# EAGLE design main_V3 (EAGLE 8.5.1)

## Sheet 1 of 8: ESP-12E Main
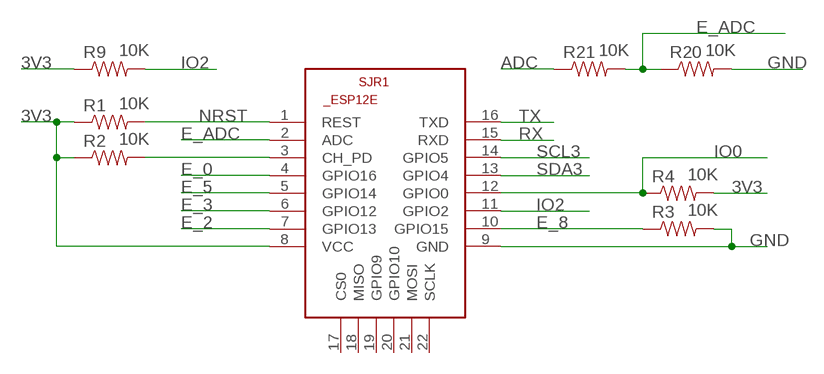
[diagram p0: schematic, sheet 1]

### Parts
R1  10K  RESISTOR1206  [1206]
R2  10K  RESISTOR1206  [1206]
R3  10K  RESISTOR1206  [1206]
R4  10K  RESISTOR1206  [1206]
R9  10K  RESISTOR1206  [1206]
R20  10K  RESISTOR1206  [1206]
R21  10K  RESISTOR1206  [1206]
SJR1  ESP8266-12EESP12E  [ESP8266-ESP12E]

### Nets
3V3: R1.1 R2.1 R4.2 R9.1 SJR1.8(VCC) ; also sheet 5,6
ADC: R21.1 ; also sheet 2
E_0: SJR1.4(GPIO16) ; also sheet 2
E_2: SJR1.7(GPIO13) ; also sheet 2
E_3: SJR1.6(GPIO12) ; also sheet 2
E_5: SJR1.5(GPIO14) ; also sheet 2
E_8: R3.1 SJR1.10(GPIO15) ; also sheet 2
E_ADC: R20.1 R21.2 SJR1.2(ADC)
GND: R3.2 R20.2 SJR1.9(GND) ; also sheet 2,3,5,7,8
IO0: R4.1 SJR1.12(GPIO0) ; also sheet 3
IO2: R9.2 SJR1.11(GPIO2)
N$2: R2.2 SJR1.3(CH_PD)
NRST: R1.2 SJR1.1(REST) ; also sheet 3
RX: SJR1.15(RXD) ; also sheet 2,3
SCL3: SJR1.14(GPIO5) ; also sheet 2,6
SDA3: SJR1.13(GPIO4) ; also sheet 2,6
TX: SJR1.16(TXD) ; also sheet 2,3
Unconnected: SJR1.17(CS0) SJR1.18(MISO) SJR1.19(GPIO9) SJR1.20(GPIO10) SJR1.21(MOSI) SJR1.22(SCLK)

## Sheet 2 of 8: Pads
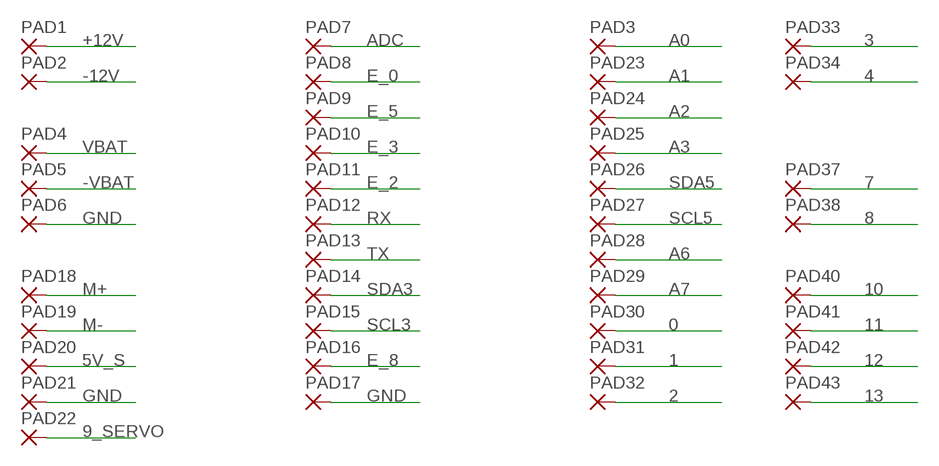
[diagram p1: schematic, sheet 2]

### Parts
PAD1  WIREPADSMD5-2,5  [5-2,5]
PAD2  WIREPADSMD5-2,5  [5-2,5]
PAD3  WIREPADSMD1,27-254  [SMD1,27-2,54]
PAD4  WIREPADSMD5-2,5  [5-2,5]
PAD5  WIREPADSMD5-2,5  [5-2,5]
PAD6  WIREPADSMD5-2,5  [5-2,5]
PAD7  WIREPADSMD1,27-254  [SMD1,27-2,54]
PAD8  WIREPADSMD1,27-254  [SMD1,27-2,54]
PAD9  WIREPADSMD1,27-254  [SMD1,27-2,54]
PAD10  WIREPADSMD1,27-254  [SMD1,27-2,54]
PAD11  WIREPADSMD1,27-254  [SMD1,27-2,54]
PAD12  WIREPADSMD1,27-254  [SMD1,27-2,54]
PAD13  WIREPADSMD1,27-254  [SMD1,27-2,54]
PAD14  WIREPADSMD1,27-254  [SMD1,27-2,54]
PAD15  WIREPADSMD1,27-254  [SMD1,27-2,54]
PAD16  WIREPADSMD1,27-254  [SMD1,27-2,54]
PAD17  WIREPADSMD1,27-254  [SMD1,27-2,54]
PAD18  WIREPADSMD1,27-254  [SMD1,27-2,54]
PAD19  WIREPADSMD1,27-254  [SMD1,27-2,54]
PAD20  WIREPADSMD1,27-254  [SMD1,27-2,54]
PAD21  WIREPADSMD1,27-254  [SMD1,27-2,54]
PAD22  WIREPADSMD1,27-254  [SMD1,27-2,54]
PAD23  WIREPADSMD1,27-254  [SMD1,27-2,54]
PAD24  WIREPADSMD1,27-254  [SMD1,27-2,54]
PAD25  WIREPADSMD1,27-254  [SMD1,27-2,54]
PAD26  WIREPADSMD1,27-254  [SMD1,27-2,54]
PAD27  WIREPADSMD1,27-254  [SMD1,27-2,54]
PAD28  WIREPADSMD1,27-254  [SMD1,27-2,54]
PAD29  WIREPADSMD1,27-254  [SMD1,27-2,54]
PAD30  WIREPADSMD1,27-254  [SMD1,27-2,54]
PAD31  WIREPADSMD1,27-254  [SMD1,27-2,54]
PAD32  WIREPADSMD1,27-254  [SMD1,27-2,54]
PAD33  WIREPADSMD1,27-254  [SMD1,27-2,54]
PAD34  WIREPADSMD1,27-254  [SMD1,27-2,54]
PAD37  WIREPADSMD1,27-254  [SMD1,27-2,54]
PAD38  WIREPADSMD1,27-254  [SMD1,27-2,54]
PAD40  WIREPADSMD1,27-254  [SMD1,27-2,54]
PAD41  WIREPADSMD1,27-254  [SMD1,27-2,54]
PAD42  WIREPADSMD1,27-254  [SMD1,27-2,54]
PAD43  WIREPADSMD1,27-254  [SMD1,27-2,54]

### Nets
0: PAD30.1(P) ; also sheet 7
1: PAD31.1(P) ; also sheet 7
2: PAD32.1(P) ; also sheet 7
3: PAD33.1(P) ; also sheet 7
4: PAD34.1(P) ; also sheet 7
5V_S: PAD20.1(P) ; also sheet 5
7: PAD37.1(P) ; also sheet 7
8: PAD38.1(P) ; also sheet 7
9_SERVO: PAD22.1(P) ; also sheet 7
10: PAD40.1(P) ; also sheet 7
11: PAD41.1(P) ; also sheet 7
12: PAD42.1(P) ; also sheet 7
13: PAD43.1(P) ; also sheet 7
+12V: PAD1.1(P) ; also sheet 4
-12V: PAD2.1(P) ; also sheet 4
-VBAT: PAD5.1(P) ; also sheet 4
A0: PAD3.1(P) ; also sheet 7
A1: PAD23.1(P) ; also sheet 7
A2: PAD24.1(P) ; also sheet 7
A3: PAD25.1(P) ; also sheet 7
A6: PAD28.1(P) ; also sheet 7
A7: PAD29.1(P) ; also sheet 7
ADC: PAD7.1(P) ; also sheet 1
E_0: PAD8.1(P) ; also sheet 1
E_2: PAD11.1(P) ; also sheet 1
E_3: PAD10.1(P) ; also sheet 1
E_5: PAD9.1(P) ; also sheet 1
E_8: PAD16.1(P) ; also sheet 1
GND: PAD6.1(P) PAD17.1(P) PAD21.1(P) ; also sheet 1,3,5,7,8
M+: PAD18.1(P) ; also sheet 8
M-: PAD19.1(P) ; also sheet 8
RX: PAD12.1(P) ; also sheet 1,3
SCL3: PAD15.1(P) ; also sheet 1,6
SCL5: PAD27.1(P) ; also sheet 6,7
SDA3: PAD14.1(P) ; also sheet 1,6
SDA5: PAD26.1(P) ; also sheet 6,7
TX: PAD13.1(P) ; also sheet 1,3
VBAT: PAD4.1(P) ; also sheet 4,5

## Sheet 3 of 8: USB Interface
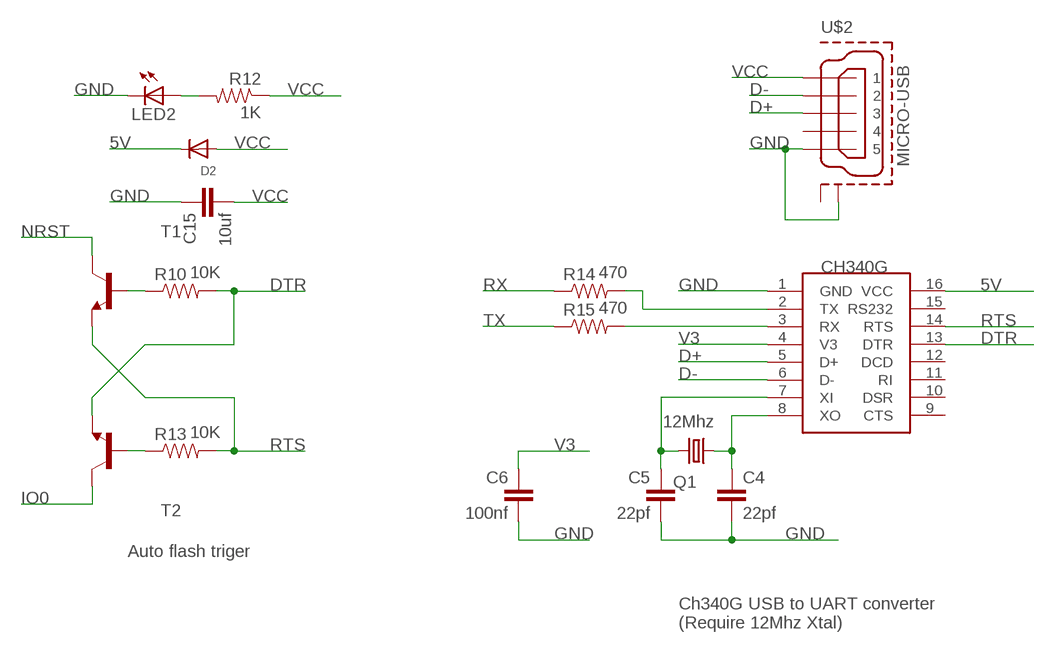
[diagram p2: schematic, sheet 3]

### Parts
C4  22pf  C-EUC1206K  [C1206K]
C5  22pf  C-EUC1206K  [C1206K]
C6  100nf  C-EUC1206K  [C1206K]
C15  10uf  C-EUC1206K  [C1206K]
D2  DIODESMA  [SMADIODE]
LED2  LEDSMT1206  [1206]
Q1  12Mhz  CSM-7X-DU  [CSM-7X-DU]
R10  10K  RESISTOR1206  [1206]
R12  1K  RESISTOR1206  [1206]
R13  10K  RESISTOR1206  [1206]
R14  470  RESISTOR1206  [1206]
R15  470  RESISTOR1206  [1206]
T1  MMBT5551LT1-NPN-SOT23-BEC  [SOT23-BEC]
T2  MMBT5551LT1-NPN-SOT23-BEC  [SOT23-BEC]
U$1  CH340G  [SOIC16]
U$2  MICRO-USB  MICRO-USB-RECEPTACLE47589-0001  [47589-0001]

### Nets
5V: D2.C U$1.16(VCC) ; also sheet 5,6,7
D+: U$1.5(D+) U$2.3
D-: U$1.6(D-) U$2.2
DTR: R10.2 T2.E U$1.13(DTR)
GND: C4.2 C5.2 C6.2 C15.1 LED2.C U$1.1(GND) U$2.5 U$2.P$2(GND2) ; also sheet 1,2,5,7,8
IO0: T2.C ; also sheet 1
N$13: C4.1 Q1.1 U$1.8(XO)
N$14: C5.1 Q1.2 U$1.7(XI)
N$15: R10.1 T1.B
N$18: R13.1 T2.B
N$19: R15.2 U$1.3(RX)
N$20: R14.2 U$1.2(TX)
N$22: LED2.A R12.2
NRST: T1.C ; also sheet 1
RTS: R13.2 T1.E U$1.14(RTS)
RX: R14.1 ; also sheet 1,2
TX: R15.1 ; also sheet 1,2
V3: C6.1 U$1.4(V3)
VCC: C15.2 D2.A R12.1 U$2.1
Unconnected: U$1.9(CTS) U$1.10(DSR) U$1.11(RI) U$1.12(DCD) U$1.15(RS232) U$2.4 U$2.P$1(GND1)

### Notes on the sheet
- Auto flash triger
- Ch340G USB to UART converter 
  (Require 12Mhz Xtal)

## Sheet 4 of 8: Lio-Ion Charging
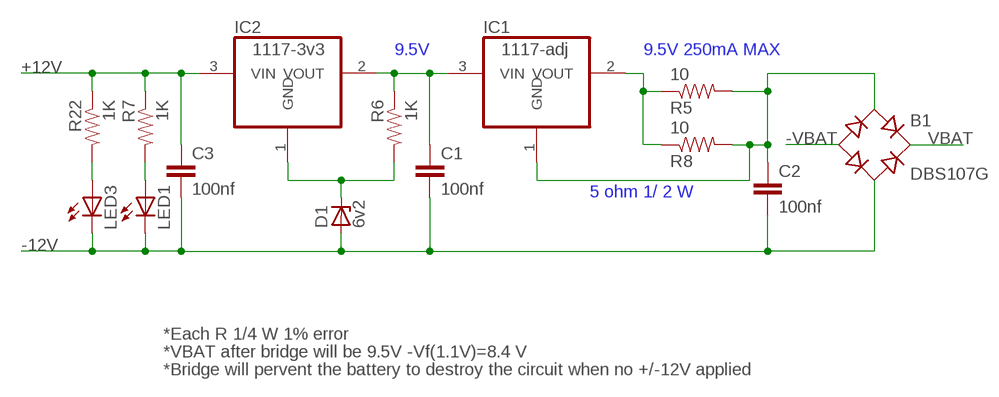
[diagram p3: schematic, sheet 4]

### Parts
B1  DBS107G  [DBS]
C1  100nf  C-EUC1206K  [C1206K]
C2  100nf  C-EUC1206K  [C1206K]
C3  100nf  C-EUC1206K  [C1206K]
D1  6v2  ZENER-DIODESOT23  [SOT23]
IC1  1117-adj  REG1117  [SOT223]
IC2  1117-3v3  REG1117  [SOT223]
LED1  LEDSMT1206  [1206]
LED3  LEDSMT1206  [1206]
R5  10  RESISTOR1206  [1206]
R6  1K  RESISTOR1206  [1206]
R7  1K  RESISTOR1206  [1206]
R8  10  RESISTOR1206  [1206]
R22  1K  RESISTOR1206  [1206]

### Nets
+12V: C3.1 IC2.3(VIN) R7.1 R22.1 ; also sheet 2
-12V: B1.AC2 C1.2 C2.2 C3.2 D1.1(A) LED1.C LED3.C ; also sheet 2
-VBAT: B1.- ; also sheet 2
N$3: D1.3(C) IC2.1(GND) R6.2
N$5: B1.AC1 C2.1 IC1.1(GND) R5.2 R8.2
N$6: IC1.2(VOUT) R5.1 R8.1
N$7: C1.1 IC1.3(VIN) IC2.2(VOUT) R6.1
N$17: LED1.A R7.2
N$23: LED3.A R22.2
VBAT: B1.+ ; also sheet 2,5

### Notes on the sheet
- 9.5V | 9.5V 250mA MAX
- 5 ohm 1/ 2 W
- *Each R 1/4 W 1% error
- *VBAT after bridge will be 9.5V -Vf(1.1V)=8.4 V
- *Bridge will pervent the battery to destroy the circuit when no +/-12V applied

## Sheet 5 of 8: power manegment
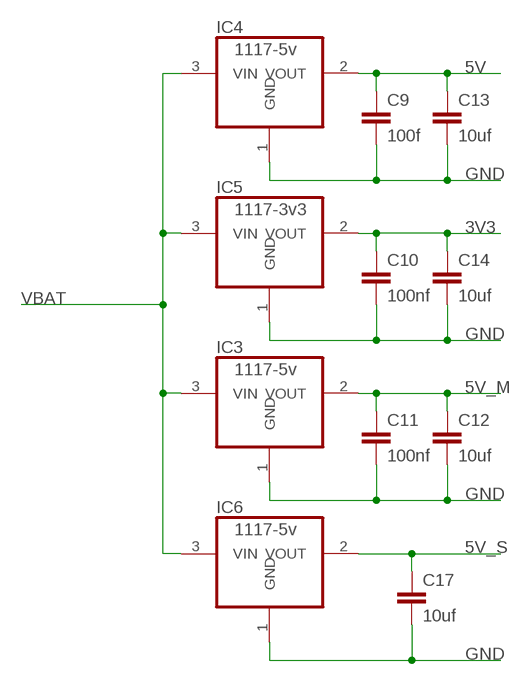
[diagram p4: schematic, sheet 5]

### Parts
C9  100f  C-EUC1206K  [C1206K]
C10  100nf  C-EUC1206K  [C1206K]
C11  100nf  C-EUC1206K  [C1206K]
C12  10uf  C-EUC1206K  [C1206K]
C13  10uf  C-EUC1206K  [C1206K]
C14  10uf  C-EUC1206K  [C1206K]
C17  10uf  C-EUC1206K  [C1206K]
IC3  1117-5v  REG1117  [SOT223]
IC4  1117-5v  REG1117  [SOT223]
IC5  1117-3v3  REG1117  [SOT223]
IC6  1117-5v  REG1117  [SOT223]

### Nets
3V3: C10.1 C14.1 IC5.2(VOUT) ; also sheet 1,6
5V: C9.1 C13.1 IC4.2(VOUT) ; also sheet 3,6,7
5V_M: C11.1 C12.1 IC3.2(VOUT) ; also sheet 8
5V_S: C17.1 IC6.2(VOUT) ; also sheet 2
GND: C9.2 C10.2 C11.2 C12.2 C13.2 C14.2 C17.2 IC3.1(GND) IC4.1(GND) IC5.1(GND) IC6.1(GND) ; also sheet 1,2,3,7,8
VBAT: IC3.3(VIN) IC4.3(VIN) IC5.3(VIN) IC6.3(VIN) ; also sheet 2,4

## Sheet 6 of 8: I2C Logic Level Converter
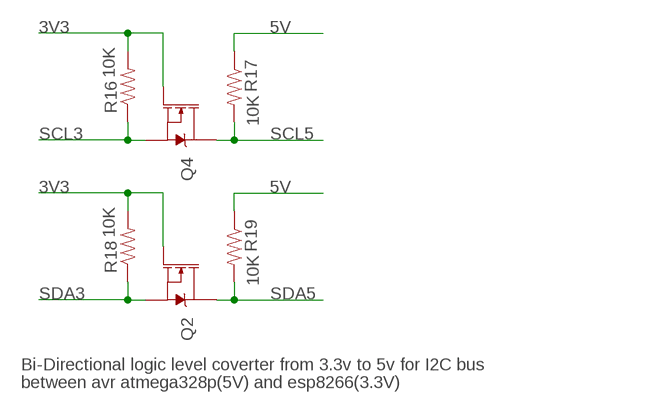
[diagram p5: schematic, sheet 6]

### Parts
Q2  MOSFET-NCH-BSS138  [SOT23-3]
Q4  MOSFET-NCH-BSS138  [SOT23-3]
R16  10K  RESISTOR1206  [1206]
R17  10K  RESISTOR1206  [1206]
R18  10K  RESISTOR1206  [1206]
R19  10K  RESISTOR1206  [1206]

### Nets
3V3: Q2.1(G) Q4.1(G) R16.2 R18.2 ; also sheet 1,5
5V: R17.1 R19.1 ; also sheet 3,5,7
SCL3: Q4.2(S) R16.1 ; also sheet 1,2
SCL5: Q4.3(D) R17.2 ; also sheet 2,7
SDA3: Q2.2(S) R18.1 ; also sheet 1,2
SDA5: Q2.3(D) R19.2 ; also sheet 2,7

### Notes on the sheet
- Bi-Directional logic level coverter from 3.3v to 5v for I2C bus
- between avr atmega328p(5V) and esp8266(3.3V)

## Sheet 7 of 8: Atmeg328p TQFP
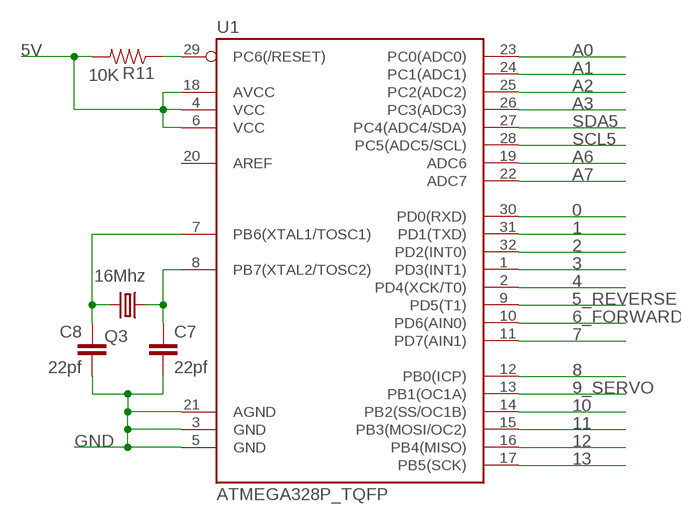
[diagram p6: schematic, sheet 7]

### Parts
C7  22pf  C-EUC1206K  [C1206K]
C8  22pf  C-EUC1206K  [C1206K]
Q3  16Mhz  CSM-7X-DU  [CSM-7X-DU]
R11  10K  RESISTOR1206  [1206]
U1  ATMEGA328P_TQFP  [TQFP32-08]

### Nets
0: U1.30(PD0(RXD)) ; also sheet 2
1: U1.31(PD1(TXD)) ; also sheet 2
2: U1.32(PD2(INT0)) ; also sheet 2
3: U1.1(PD3(INT1)) ; also sheet 2
4: U1.2(PD4(XCK/T0)) ; also sheet 2
5_REVERSE: U1.9(PD5(T1)) ; also sheet 8
5V: R11.2 U1.4(VCC) U1.6(VCC) U1.18(AVCC) ; also sheet 3,5,6
6_FORWARD: U1.10(PD6(AIN0)) ; also sheet 8
7: U1.11(PD7(AIN1)) ; also sheet 2
8: U1.12(PB0(ICP)) ; also sheet 2
9_SERVO: U1.13(PB1(OC1A)) ; also sheet 2
10: U1.14(PB2(SS/OC1B)) ; also sheet 2
11: U1.15(PB3(MOSI/OC2)) ; also sheet 2
12: U1.16(PB4(MISO)) ; also sheet 2
13: U1.17(PB5(SCK)) ; also sheet 2
A0: U1.23(PC0(ADC0)) ; also sheet 2
A1: U1.24(PC1(ADC1)) ; also sheet 2
A2: U1.25(PC2(ADC2)) ; also sheet 2
A3: U1.26(PC3(ADC3)) ; also sheet 2
A6: U1.19(ADC6) ; also sheet 2
A7: U1.22(ADC7) ; also sheet 2
GND: C7.2 C8.2 U1.3(GND) U1.5(GND) U1.21(AGND) ; also sheet 1,2,3,5,8
N$1: C7.1 Q3.1 U1.8(PB7(XTAL2/TOSC2))
N$16: C8.1 Q3.2 U1.7(PB6(XTAL1/TOSC1))
N$21: R11.1 U1.29(PC6(/RESET))
SCL5: U1.28(PC5(ADC5/SCL)) ; also sheet 2,6
SDA5: U1.27(PC4(ADC4/SDA)) ; also sheet 2,6
Unconnected: U1.20(AREF)

## Sheet 8 of 8: DC H-Bridge
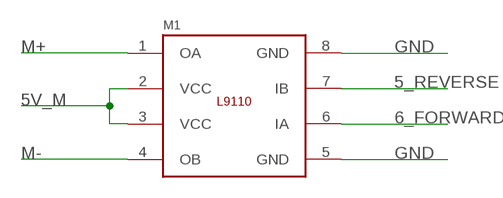
[diagram p7: schematic, sheet 8]

### Parts
M1  L9110  [SO8P]

### Nets
5_REVERSE: M1.7(IB) ; also sheet 7
5V_M: M1.2(VCC) M1.3(VCC) ; also sheet 5
6_FORWARD: M1.6(IA) ; also sheet 7
GND: M1.5(GND) M1.8(GND) ; also sheet 1,2,3,5,7
M+: M1.1(OA) ; also sheet 2
M-: M1.4(OB) ; also sheet 2

## Library data of the parts
B1 = rectifier:DB?*G: Single Phase 1.0 AMP Glass Passivated Bridge Rectifier Taiwan Semiconductor Co.,Ltd. - TSC Source: http://www.taiwansemi.com/TSCbig5/ezcatfiles/cust/img/img/db101g.pdf http://www.ts.com.tw/db/pictures/modules/PDT/PDT060207001/DBLS201G.pdf
C1-C15 C17 = rcl:C-EU: CAPACITOR, European symbol; SPICEPREFIX: C
D1 = diode:ZENER-DIODE: Z-Diode
D2 = adafruit:DIODE: Diode SMADIODE - SMA Surface Mount Package 20V 1A Schottky Diode Digikey: 641-1014-6-ND DO-1N4148 - Through Hole Small Current Diode SOD-123 20V 1 A (.5mV Vf) Schottky Diode - Digikey: MBRX120TPMSCT-ND SOD-323 10V 570mA (.38mV Vf, 3ns) Schottky Diode - Digikey: ZLLS410CT-ND SOD-523 30V 30mA Schottky Diode (RB751S-40TE61) - Digikey: RB751S-40TE61CT-ND SOT23-R/W - SOT23 Package (R = Solder Paste/Reflow Ovens, W = Hand-Soldering) BAT54Film 40V 300mA - Digikey: 497-7162-1-ND
IC1-IC6 = burr-brown:REG1117: 800mA and 1A Low Dropout (LDO) Positive Regulator 1.8V, 2.5V, 2.85V, 3.3V, 5V, and Adj; MPN: REG1117; OC_FARNELL: 1097566; OC_NEWARK: 14P6981
LED1-LED3 = adafruit:LED: LED OSRAM: - CHIPLED LG R971, LG N971, LY N971, LG Q971, LY Q971, LO R971, LY R971 LH N974, LH R974 LS Q976, LO Q976, LY Q976 LO Q996 - Hyper CHIPLED LW Q18S LB Q993, LB Q99A, LB R99A - SideLED LS A670, LO A670, LY A670, LG A670, LP A670 LB A673, LV A673, LT A673, LW A673 LH A674 LY A675 LS A676, LA A676, LO A676, LY A676, LW A676 LS A679, LY A679, LG A679 - Hyper Micro SIDELED® LS Y876, LA Y876, LO Y876, LY Y876 LT Y87S - SmartLED LW L88C, LW L88S LB L89C, LB L89S, LG L890 LS L89K, LO L89K, LY L89K LS L896, LA L896, LO L896, LY L896 - TOPLED LS T670, LO T670, LY T670, LG T670, LP T670 LSG T670, LSP T670, LSY T670, LOP T670, LYG T670 LG T671, LOG T671, LSG T671 LB T673, LV T673, LT T673, LW T673 LH T674 LS T676, LA T676, LO T676, LY T676, LB T676, LH T676, LSB T676, LW T676 LB T67C, LV T67C, LT T67C, LS T67K, LO T67K, LY T67K, LW E67C LS E67B, LA E67B, LO E67B, LY E67B, LB E67C, LV E67C, LT E67C LW T67C LS T679, LY T679, LG T679 LS T770, LO T770, LY T770, LG T770, LP T770 LB T773, LV T773, LT T773, LW T773 LH T774 LS E675, LA E675, LY E675, LS T675 LS T776, LA T776, LO T776, LY T776, LB T776 LHGB T686 LT T68C, LB T68C - Hyper Mini TOPLED® LB M676 - Mini TOPLED Santana® LG M470 LS M47K, LO M47K, LY M47K Source: http://www.osram.convergy.de/
M1 = FaBo-Motor:L9110
PAD1-PAD34 PAD37 PAD38 PAD40-PAD43 = wirepad:WIREPAD: Wire PAD connect wire on PCB
Q1 Q3 = crystal:CSM-7X-DU: SMD CRYSTAL Source: www.ecsxtal.com .. Crystal 3.6864MHz CSM_7X_DU.PDF; OC_FARNELL: unknown; OC_NEWARK: unknown
Q2 Q4 = SparkFun-DiscreteSemi:MOSFET-NCH: N-channel MOSFETs Voltage controlled devices that allow control of high current outputs. SparkFun Products: SparkFun OpenScale <https://www.sparkfun.com/products/13261> SparkFun Digital Sandbox <https://www.sparkfun.com/products/12651> SparkFun Monster Moto Shield <https://www.sparkfun.com/products/10182> SparkFun MOSFET Power Controller <https://www.sparkfun.com/products/11214>; PROD_ID: TRANS-00830; VALUE: 220mA/50V/3.5Ω
R1-R22 = SparkFun:RESISTOR: Resistor Basic schematic elements and footprints for 0603, 1206, and PTH 1/10th watt (small) resistors.
SJR1 = esp12e:ESP8266-12E: ESP8266-12E Library for Eagle CAD The author not responsible for any damages or errors!. Created by Suhail jr.lt;/author>
T1 T2 = DC_LOAD_AU:*-NPN-: NPN Transistror BF959 corrected 2008.03.06
U1 = SparkFun-IC-Microcontroller:ATMEGA328P_TQFP: Popular 328P in QFP Storefront component: ATmega328 - TQFP <https://www.sparkfun.com/products/13448> (COM-13448) Datasheet <http://www.sparkfun.com/datasheets/Components/SMD/ATMega328.pdf> SparkFun Products SparkFun RedBoard - Programmed with Arduino <https://www.sparkfun.com/products/12757> (DEV-12757) Arduino Pro Mini 328 - 5V/16MHz <https://www.sparkfun.com/products/11113> (DEV-11113) Arduino Pro Mini 328 - 3.3V/8MHz <https://www.sparkfun.com/products/11114> (DEV-11114) SparkFun OpenLog <https://www.sparkfun.com/products/13712> (DEV-13712) SparkFun MicroView - OLED Arduino Module <https://www.sparkfun.com/products/12923> (DEV-12923) SparkFun Digital Sandbox <https://www.sparkfun.com/products/12651> (DEV-12651) SparkFun PicoBoard <https://www.sparkfun.com/products/11888> (WIG-11888) Arduino Fio <https://www.sparkfun.com/products/10116> (DEV-10116) LilyPad Arduino 328 Main Board <https://www.sparkfun.com/products/13342> (DEV-13342) SparkFun RedStick <https://www.sparkfun.com/products/13741> (DEV-13741) LilyPad MP3 <https://www.sparkfun.com/products/11013> (DEV-11013) LilyPad Arduino SimpleSnap <https://www.sparkfun.com/products/10941> (DEV-10941) SparkFun Stepoko <https://www.sparkfun.com/products/13899> (ROB-13899) SparkFun Geiger Counter <https://www.sparkfun.com/products/11345> (SEN-11345) SparkFun EL Sequencer <https://www.sparkfun.com/products/12781> (COM-12781) Arduino Pro 328 - 5V/16MHz <https://www.sparkfun.com/products/10915> (DEV-10915) CryptoCape <https://www.sparkfun.com/products/12773> (DEV-12773) SparkFun IR Thermometer Evaluation Board - MLX90614 <https://www.sparkfun.com/products/10740> (SEN-10740) SparkFun RedBot Mainboard <https://www.sparkfun.com/products/12097> (ROB-12097) Arduino Pro 328 - 3.3V/8MHz <https://www.sparkfun.com/products/10914> (DEV-10914) SparkFun Block for Intel® Edison - Arduino <https://www.sparkfun.com/products/13036> (DEV-13036) SparkFun Simon Says - Surface Mount Soldering Kit <https://www.sparkfun.com/products/10935> (KIT-10935) SparkFun 7-Segment Serial Display - Red <https://www.sparkfun.com/products/11441> (COM-11441) SparkFun 7-Segment Serial Display - White <https://www.sparkfun.com/products/11629> (COM-11629) SparkFun 7-Segment Serial Display - Yellow <https://www.sparkfun.com/products/11443> (COM-11443) SparkFun 7-Segment Serial Display - Kelly Green <https://www.sparkfun.com/products/11440> (COM-11440) SparkFun 7-Segment Serial Display - Blue <https://www.sparkfun.com/products/11442> (COM-11442) SparkFun OpenSegment Serial Display - 20mm (Blue) <https://www.sparkfun.com/products/11647> (COM-11647) SparkFun OpenSegment Serial Display - 20mm (Green) <https://www.sparkfun.com/products/11646> (COM-11646) SparkFun OpenSegment Serial Display - 20mm (White) <https://www.sparkfun.com/products/11648> (COM-11648) SparkFun OpenSegment Serial Display - 20mm (Red) <https://www.sparkfun.com/products/11644> (COM-11644) SparkFun OpenSegment Serial Display - 20mm (Yellow) <https://www.sparkfun.com/products/11645> (COM-11645) SparkFun OpenSegment Shield <https://www.sparkfun.com/products/13190> (DEV-13190); PROD_ID: IC-09069
U$1 = ch340g:CH340G
U$2 = con-molex-usb:MICRO-USB-RECEPTACLE: MICRO USB RECEPTACLES Micro-USB Receptacles, SMT, Lead-Free from MOLEX <http://www.molex.com/>. (C) 2014 Tomasz Boleslaw CEDRO, cederom@tlen.pl, http://www.tomek.cedro.info. Version 0.1 (2014-01-17): Initial release. Version 0.2 (2014-02-06): Updated 47589-0001 footprint pins/pads/milling. Following devices are included: 1. 47589-0001 Micro-USB AB Receptacle, Bottom Mount, SMT, Lead-Free <http://www.molex.com/molex/products/datasheet.jsp?part=active/0475890001_IO_CONNECTORS.xml> (Technical Drawing <http://www.molex.com/pdm_docs/sd/475890001_sd.pdf>).

## Board
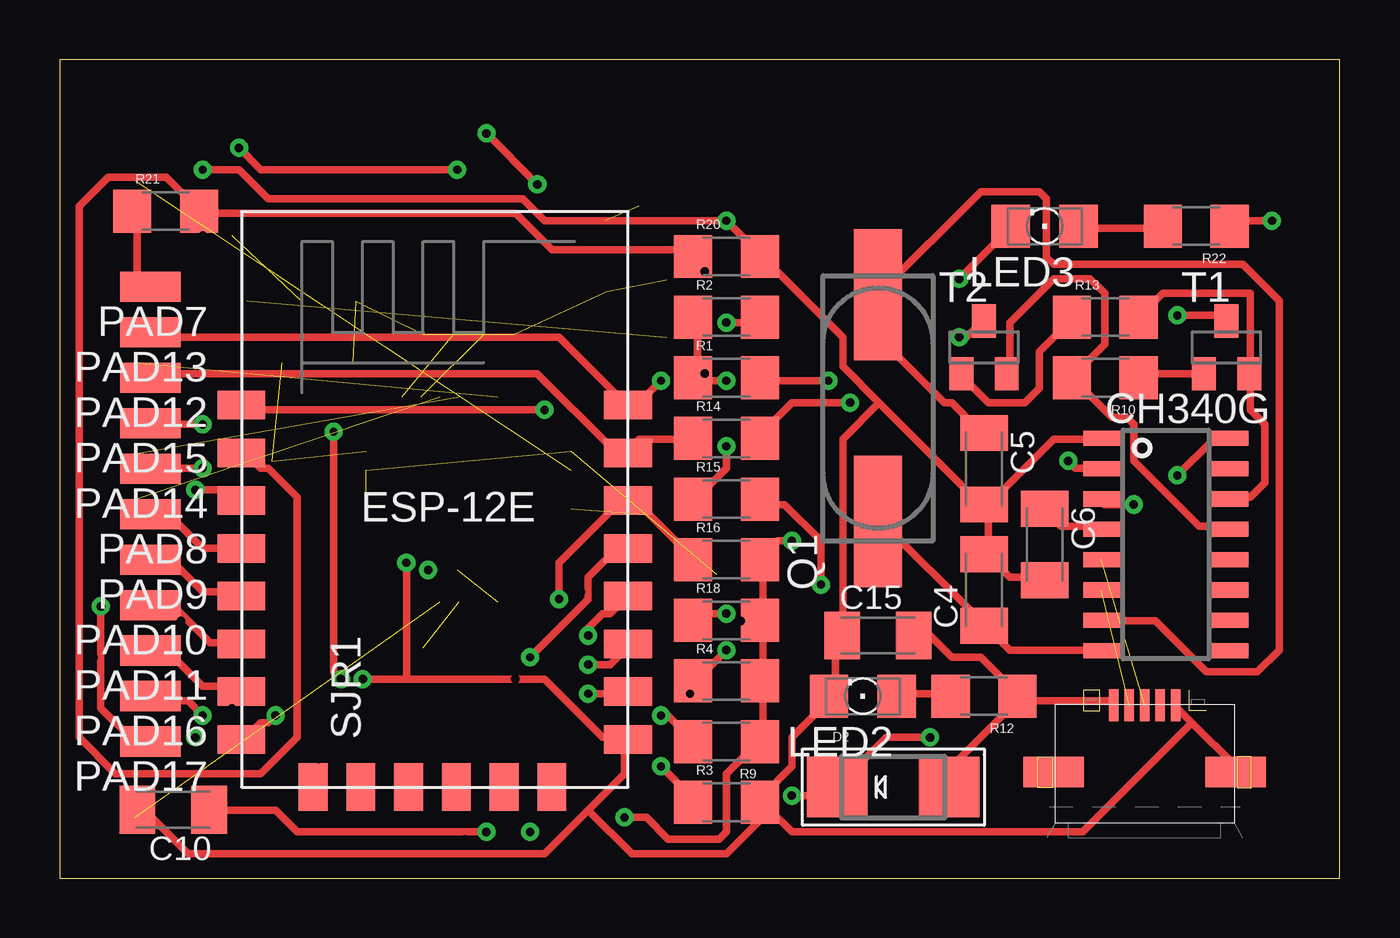
[diagram p8: board, top side]
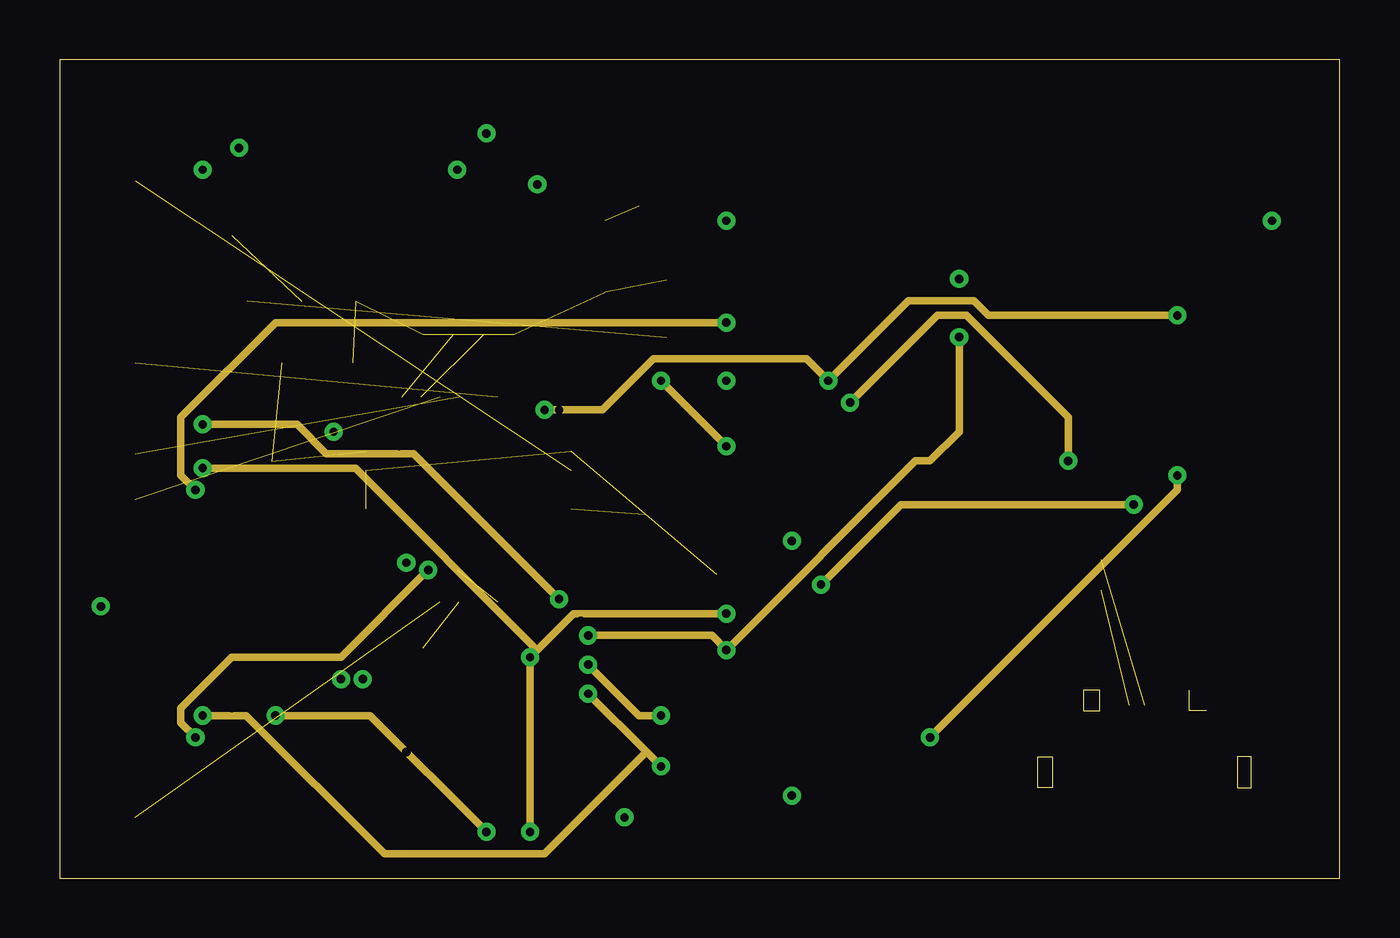
[diagram p9: board, inner layer Route2]
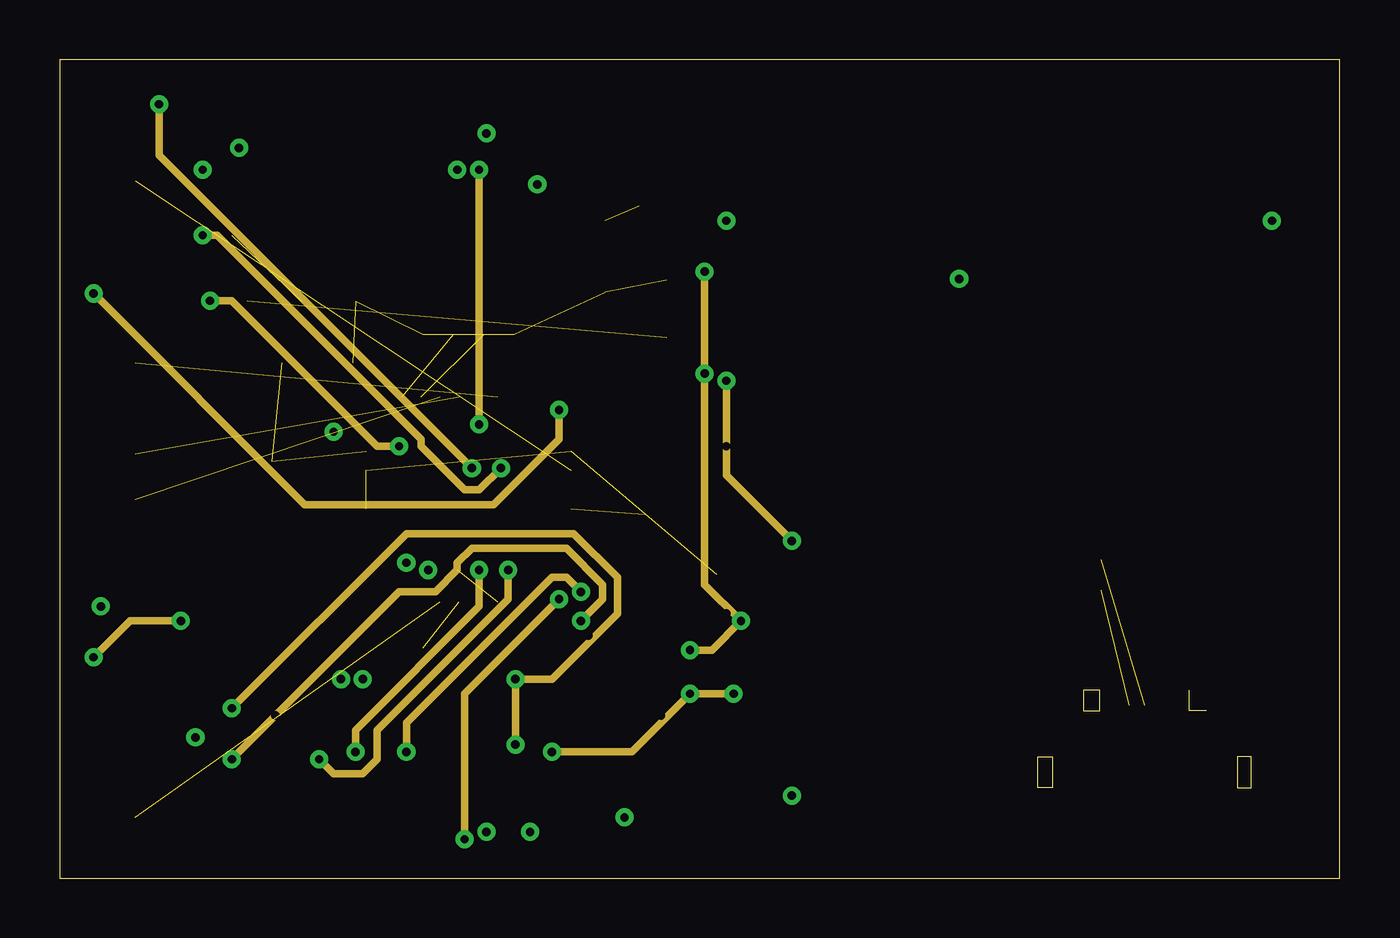
[diagram p10: board, inner layer Route15]
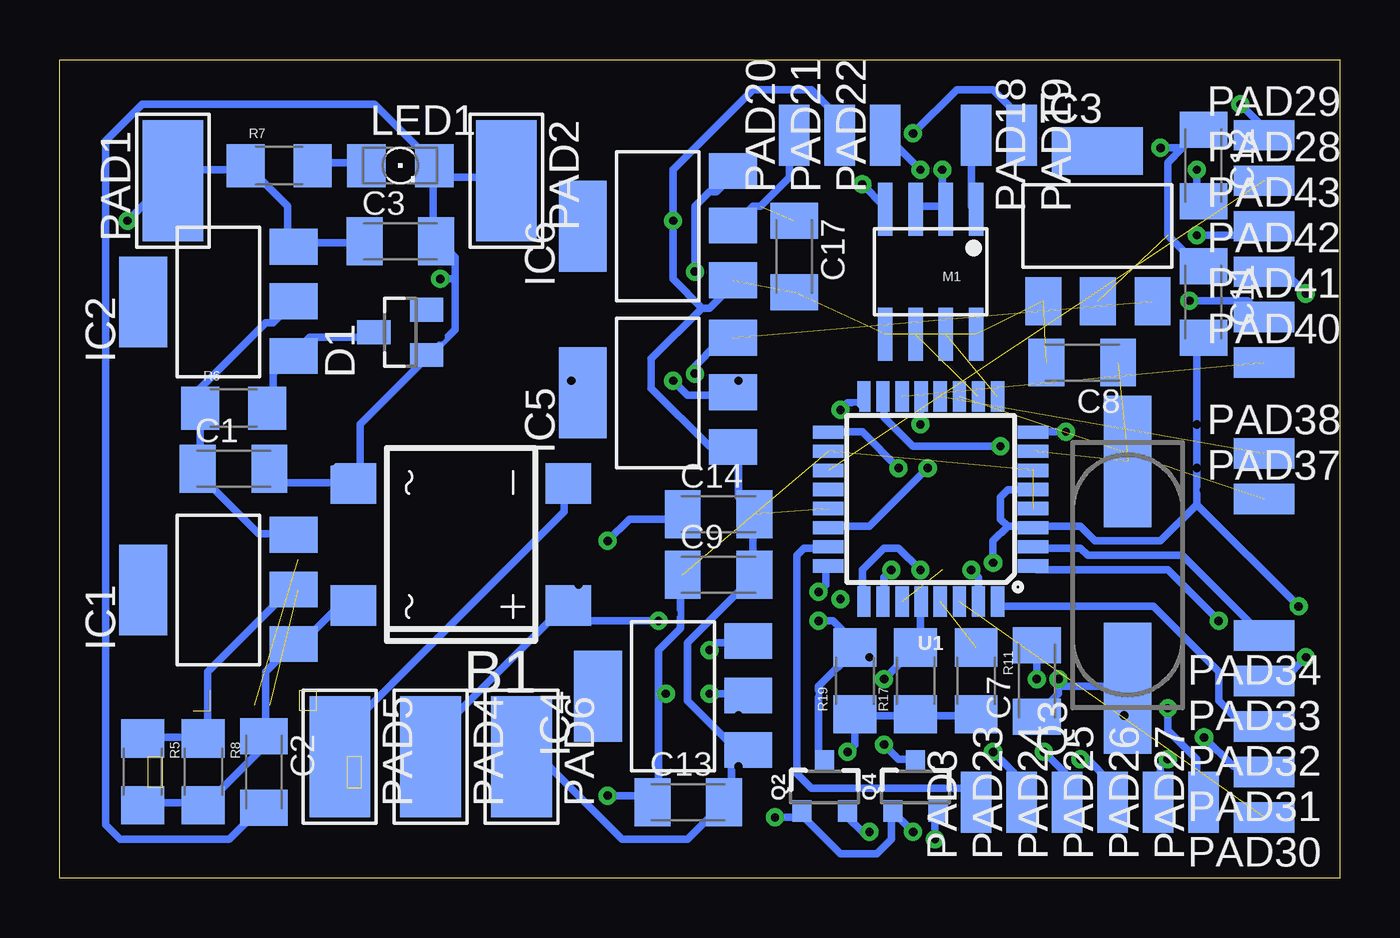
[diagram p11: board, bottom side, seen from below]

Size 53.64 x 34.28 mm. Coordinates in mm from the lower left corner, seen from the top.
Outline: 0,0 53.64,0 53.64,34.28 0,34.28 0,0
Copper layers ((1*2)+(15*16)): Top 0.035mm / dielectric 1.5mm / Route2 0.035mm / dielectric 0.15mm / Route15 0.035mm / dielectric 0.2mm / Bottom 0.035mm
Design rules "default *": minimum track width 12mil, minimum drill 0.35mm, track to track 12mil, track to pad 12mil, pad to pad 6mil, via to via 6mil, smd to smd 6mil, copper to edge 24mil, drill to drill 6mil, minimum pad ring 10mil, minimum via ring 8mil, stop-mask expansion 4mil, vias tented up to drill 0mil, thermal gap 10mil

### Footprints (pad centres in the part's own frame; a part is rotated, then mirrored left to right if it is on the bottom)
DBS = smd 1.7 x 1.9: + -2.55,-4.5; - 2.55,-4.5; AC1 -2.55,4.5; AC2 2.55,4.5
C1206K = smd 1.5 x 2: 1 -1.5,0; 2 1.5,0
SOT23 = smd 1 x 1.4: 1 -0.95,-1.1; 2 0.95,-1.1; 3 0,1.1
SMADIODE = smd 2.54 x 2.54: A 2.349,0; C -2.349,0
SOT223 = smd 1.499 x 2.007: 1 -2.261,-3.15; 2 0.025,-3.15; 3 2.311,-3.15 | smd 3.81 x 2.007: 4 0,3.15
1206 = smd 1.6 x 1.803: A -1.422,0; C 1.422,0
SO8P = smd 0.61 x 2.21: 1 -1.905,-2.616; 2 -0.635,-2.616; 3 0.635,-2.616; 4 1.905,-2.616; 5 1.905,2.616; 6 0.635,2.616; 7 -0.635,2.616; 8 -1.905,2.616
5-2,5 = smd 2.54 x 5.08: 1 0,0
SMD1,27-2,54 = smd 1.27 x 2.54: 1 0,0
CSM-7X-DU = smd 5.5 x 2: 1 -4.75,0; 2 4.75,0
SOT23-3 = smd 0.8 x 0.9: 1 -0.95,-1; 2 0.95,-1; 3 0,1.1
1206' = smd 1.6 x 1.8: 1 -1.4,0; 2 1.4,0
ESP8266-ESP12E = smd 2 x 1.2: 1 -7.62,5.84; 2 -7.62,3.84; 3 -7.62,1.84; 4 -7.62,-0.16; 5 -7.62,-2.16; 6 -7.62,-4.16; 7 -7.62,-6.16; 8 -7.62,-8.16; 9 8.58,-8.16; 10 8.58,-6.16; 11 8.58,-4.16; 12 8.58,-2.16; 13 8.58,-0.16; 14 8.58,1.84; 15 8.58,3.84; 16 8.58,5.84 | smd 1.2 x 2: 17 -4.62,-10.16; 18 -2.62,-10.16; 19 -0.62,-10.16; 20 1.38,-10.16; 21 3.38,-10.16; 22 5.38,-10.16
SOT23-BEC = smd 1 x 1.4: B -0.95,-1.1; C 0,1.1; E 0.95,-1.1
TQFP32-08 = smd 1.27 x 0.559: 1 -4.293,2.8; 2 -4.293,2; 3 -4.293,1.2; 4 -4.293,0.4; 5 -4.293,-0.4; 6 -4.293,-1.2; 7 -4.293,-2; 8 -4.293,-2.8; 17 4.293,-2.8; 18 4.293,-2; 19 4.293,-1.2; 20 4.293,-0.4; 21 4.293,0.4; 22 4.293,1.2; 23 4.293,2; 24 4.293,2.8 | smd 0.559 x 1.27: 9 -2.8,-4.293; 10 -2,-4.293; 11 -1.2,-4.293; 12 -0.4,-4.293; 13 0.4,-4.293; 14 1.2,-4.293; 15 2,-4.293; 16 2.8,-4.293; 25 2.8,4.293; 26 2,4.293; 27 1.2,4.293; 28 0.4,4.293; 29 -0.4,4.293; 30 -1.2,4.293; 31 -2,4.293; 32 -2.8,4.293
SOIC16 = smd 0.635 x 1.524: 1 -4.445,-2.695; 2 -3.175,-2.695; 3 -1.905,-2.695; 4 -0.635,-2.695; 5 0.635,-2.695; 6 1.905,-2.695; 7 3.175,-2.695; 8 4.445,-2.695; 9 4.445,2.695; 10 3.175,2.695; 11 1.905,2.695; 12 0.635,2.695; 13 -0.635,2.695; 14 -1.905,2.695; 15 -3.175,2.695; 16 -4.445,2.695
47589-0001 = smd 1.35 x 0.4: 1 2.8,1.3; 2 2.8,0.65; 3 2.8,0; 4 2.8,-0.65; 5 2.8,-1.3 | smd 1.27 x 2.54: P$1 0,3.81; P$2 0,-3.81

### Placement (x,y rotation side)
B1  36.83,13.97 90 bottom
C1  46.36,17.14 0 bottom
C2  45.08,4.45 270 bottom
C3  39.37,26.67 0 bottom
C4  38.73,12.07 90 top
C5  38.73,17.14 270 top
C6  41.28,13.97 270 top
C7  12.7,8.25 90 bottom
C8  10.8,21.59 180 bottom
C9  26.03,12.7 0 bottom
C10  4.76,2.86 180 top
C11  5.71,24.13 270 bottom
C12  5.71,29.84 270 bottom
C13  27.3,3.17 0 bottom
C14  26.03,15.24 0 bottom
C15  34.29,10.16 0 top
C17  22.86,26.04 270 bottom
D1  39.37,22.86 90 bottom
D2  34.92,3.81 0 top
IC1  46.99,12.07 90 bottom
IC2  46.99,24.13 90 bottom
IC3  10.16,27.3 0 bottom
IC4  27.94,7.62 90 bottom
IC5  28.58,20.32 90 bottom
IC6  28.58,27.3 90 bottom
LED1  39.37,29.84 0 bottom
LED2  33.66,7.62 180 top
LED3  41.28,27.3 180 top
M1  17.14,25.4 180 bottom
PAD1  48.89,29.21 0 bottom
PAD2  34.92,29.21 180 bottom
PAD3  15.24,3.17 0 bottom
PAD4  38.1,5.08 180 bottom
PAD5  41.91,5.08 180 bottom
PAD6  34.29,5.08 180 bottom
PAD7  3.81,24.77 90 top
PAD8  3.81,15.24 90 top
PAD9  3.81,13.34 90 top
PAD10  3.81,11.43 90 top
PAD11  3.81,9.53 90 top
PAD12  3.81,20.95 90 top
PAD13  3.81,22.86 90 top
PAD14  3.81,17.14 90 top
PAD15  3.81,19.05 90 top
PAD16  3.81,7.62 90 top
PAD17  3.81,5.71 90 top
PAD18  15.24,31.11 180 bottom
PAD19  13.34,31.11 180 bottom
PAD20  22.86,31.11 0 bottom
PAD21  20.95,31.11 0 bottom
PAD22  19.05,31.11 0 bottom
PAD23  13.34,3.17 0 bottom
PAD24  11.43,3.17 0 bottom
PAD25  9.52,3.17 0 bottom
PAD26  7.62,3.17 0 bottom
PAD27  5.71,3.17 0 bottom
PAD28  3.17,29.21 270 bottom
PAD29  3.17,31.11 270 bottom
PAD30  3.17,2.54 90 bottom
PAD31  3.17,4.45 90 bottom
PAD32  3.17,6.35 90 bottom
PAD33  3.17,8.25 90 bottom
PAD34  3.17,10.16 90 bottom
PAD37  3.17,15.88 270 bottom
PAD38  3.17,17.78 270 bottom
PAD40  3.17,21.59 270 bottom
PAD41  3.17,23.49 270 bottom
PAD42  3.17,25.4 270 bottom
PAD43  3.17,27.3 270 bottom
Q1  34.29,19.68 90 top
Q2  21.59,3.81 0 bottom
Q3  8.89,12.7 90 bottom
Q4  17.78,3.81 0 bottom
R1  10K  [1206']  27.94,20.95 0 top
R2  10K  [1206']  27.94,23.49 0 top
R3  10K  [1206']  27.94,3.17 0 top
R4  10K  [1206']  27.94,8.25 0 top
R5  10  [1206']  50.17,4.45 270 bottom
R6  1K  [1206']  46.36,19.68 0 bottom
R7  1K  [1206']  44.45,29.84 0 bottom
R8  10  [1206']  47.62,4.45 270 bottom
R9  10K  [1206']  27.94,5.71 180 top
R10  10K  [1206']  43.81,20.95 180 top
R11  10K  [1206']  15.24,8.25 270 bottom
R12  1K  [1206']  38.73,7.62 180 top
R13  10K  [1206']  43.81,23.49 0 top
R14  470  [1206']  27.94,18.41 0 top
R15  470  [1206']  27.94,15.88 0 top
R16  10K  [1206']  27.94,13.34 0 top
R17  10K  [1206']  17.78,8.25 90 bottom
R18  10K  [1206']  27.94,10.8 0 top
R19  10K  [1206']  20.32,8.25 90 bottom
R20  10K  [1206']  27.94,26.04 0 top
R21  10K  [1206']  4.45,27.94 0 top
R22  1K  [1206']  47.62,27.3 180 top
SJR1  15.24,13.97 0 top
T1  48.89,22.22 0 top
T2  38.73,22.22 0 top
U1  17.14,15.88 180 bottom
U$1  46.36,13.97 270 top
U$2  45.47,4.44 90 top

### Tracks (layer width: path | path; a pad name or v marks a point on that pad's centre or on a via)
0  (1 unrouted)
1  (via drill 0.35)
  Route2 0.305: v15.44,12.9 11.79,9.25 7.21,9.25 5.08,7.11 5.08,6.5 v5.69,5.89
  Bottom 0.305: v15.44,12.9 15.14,12.6 15.14,11.68 U1.31 | v5.69,5.89 4.47,4.67 3.25,4.67 PAD31.1
2
  Bottom 0.305: U1.32 14.22,11.38 7.82,11.38 5.08,8.64 5.08,7.42 4.17,6.5 3.25,6.5 PAD32.1
3  (via drill 0.35 layers 15-16)
  Route15 0.305: v5.08,10.77 2.95,10.77 v1.42,9.25
  Bottom 0.305: v5.08,10.77 7.21,12.9 12.7,12.9 U1.1 | v1.42,9.25 2.34,8.33 2.95,8.33 PAD33.1
3V3  (via drill 0.35, 0.35 layers 1-2)
  Top 0.305: v17.88,1.93 9.96,1.93 9.04,2.85 6.3,2.85 C10.1 | v9.04,6.81 8.74,6.5 8.43,6.5 7.82,5.89 SJR1.8 | R2.1 26.72,23.27 26.72,21.13 R1.1 26.72,20.83 v27.94,20.83 | v30.68,14.12 30.07,14.12 29.46,13.51 R16.2 29.46,13.21 29.46,11.07 R18.2 29.46,10.77 29.46,8.33 R4.2 29.46,8.03 29.46,5.89 R9.1 29.16,5.59 27.94,4.37 27.94,1.93 27.64,1.63 25.5,1.63 24.59,2.54 v23.67,2.54
  Route2 0.305: v9.04,6.81 13.01,6.81 v17.88,1.93
  Route15 0.305: v27.94,20.83 27.94,16.87 v30.68,14.12
  Bottom 0.305: v17.88,1.93 18.49,2.54 Q4.1 18.8,2.54 18.8,1.63 19.41,1.02 20.93,1.02 22.45,2.54 Q2.1 22.76,2.54 v23.67,2.54 | v27.94,20.83 27.33,20.22 25.5,20.22 IC5.2 | v30.68,14.12 29.77,15.04 27.64,15.04 C14.1
4
  Bottom 0.305: U1.2 12.7,13.82 10.87,13.82 10.57,13.51 6.6,13.51 3.25,10.16 PAD34.1
5_REVERSE  (1 unrouted)
5V  (via drill 0.35, 0.35 layers 1-2, 0.35 layers 15-16)  (3 unrouted)
  Top 0.305: v46.84,16.87 48.36,18.39 48.97,18.39 U$1.16 | v36.47,5.89 34.65,5.89 32.82,4.06 D2.C 32.51,3.76 32.21,3.45 v30.68,3.45
  Route2 0.305: v46.84,16.87 46.84,16.26 v36.47,5.89
  Route15 0.305: v28.25,7.72 v26.42,7.72 23.98,5.28 v20.62,5.28
  Bottom 0.305: R11.2 15.44,6.81 17.58,6.81 R17.1 17.88,6.81 20.32,6.81 | 28.55,7.72 28.55,9.55 27.64,10.46 27.64,12.6 C9.1 | 28.55,7.72 28.55,3.45 C13.1 28.85,3.45 v30.68,3.45 | v26.42,7.72 24.89,7.72 IC4.2 | 28.55,7.72 v28.25,7.72 | 20.32,6.81 20.32,5.59 v20.62,5.28 | 20.32,6.81 R19.1
5V_M  (via drill 0.35)  (1 unrouted)
  Top 0.305: v16.66,29.67 8.43,29.67 v7.52,30.58
  Bottom 0.305: 16.66,28.14 17.58,28.14 M1.3 | 6.6,30.58 5.99,31.19 C12.1 | 6.6,30.58 7.21,29.97 7.21,26.92 5.99,25.7 C11.1 | v16.66,29.67 16.66,28.14 | 6.6,30.58 v7.52,30.58 | 16.66,28.14 M1.2
5V_S  (1 unrouted)
  Bottom 0.305: IC6.2 25.2,27.53 24.59,28.14 24.28,28.14 23.06,29.36 23.06,30.89 PAD20.1
6_FORWARD  (1 unrouted)
7  (1 unrouted)
8  (1 unrouted)
9_SERVO  (via drill 0.35 layers 15-16)
  Route15 0.305: v17.58,29.67 v17.58,19
  Bottom 0.305: v17.58,19 17.58,19.91 U1.13 | v17.58,29.67 18.8,30.89 PAD22.1
10  (1 unrouted)
11  (via drill 0.35 layers 15-16)
  Route15 0.305: v14.22,18.09 13.31,18.09 7.21,24.18 v6.3,24.18
  Bottom 0.305: v14.22,18.09 17.88,18.09 19.1,19.3 19.1,19.91 U1.15 | v6.3,24.18 3.86,24.18 PAD41.1
12  (via drill 0.35 layers 15-16)
  Route15 0.305: v20.93,19.61 20.93,18.39 18.19,15.65 10.26,15.65 v1.42,24.49
  Bottom 0.305: v20.93,19.61 20.62,19.91 20.02,19.91 U1.16 | v1.42,24.49 2.34,25.4 PAD42.1
13  (via drill 0.35 layers 15-16)
  Route15 0.305: v18.49,17.17 17.58,16.26 16.97,16.26 15.14,18.09 15.14,18.39 6.6,26.92 v5.99,26.92
  Bottom 0.305: v18.49,17.17 20.02,18.69 21.23,18.69 U1.17 | v5.99,26.92 3.56,26.92 PAD43.1
+12V  (via drill 0.35)
  Top 0.305: v50.8,27.53 49.28,27.53 R22.1
  Bottom 0.305: C3.1 41.05,26.62 43.79,26.62 IC2.3 44.09,26.62 44.09,28.14 45.62,29.67 R7.1 45.92,29.67 48.36,29.67 48.67,29.36 PAD1.1 48.97,29.36 v50.8,27.53
-12V  (via drill 0.35)
  Top 0.305: v37.69,25.09 39.83,27.23 LED3.C
  Bottom 0.305: C1.2 44.7,16.87 44.4,16.56 41.35,16.56 B1.AC2 41.05,16.56 41.05,19 38.3,21.74 D1.1 38,22.05 37.08,22.96 37.08,25.09 | 37.08,25.09 37.08,26.01 37.69,26.62 C3.2 38,26.92 38,29.36 | 37.08,25.09 v37.69,25.09 | 38,29.36 38,29.67 LED1.C | C2.2 45.31,2.85 46.53,1.63 51.11,1.63 51.71,2.23 51.71,30.89 50.19,32.41 40.44,32.41 38,29.97 LED1.C | 38,29.36 34.95,29.36 PAD2.1 | 38,29.36 LED1.C
-VBAT
  Bottom 0.305: B1.- 32.51,16.26 32.51,15.34 41.66,6.2 41.66,5.28 PAD5.1
A0
  Bottom 0.305: U1.23 21.54,13.82 22.45,13.82 22.76,13.51 22.76,4.37 22.15,3.76 15.75,3.76 15.44,3.45 PAD3.1
A1  (via drill 0.35 layers 15-16)
  Route15 0.305: v21.84,11.99 21.23,12.6 20.62,12.6 14.53,6.5 v14.53,5.28
  Bottom 0.305: v21.84,11.99 21.54,12.29 21.54,12.9 U1.24 | v14.53,5.28 13.61,4.37 13.61,3.45 PAD23.1
A2  (via drill 0.35 layers 15-16)
  Route15 0.305: v17.58,12.9 17.58,11.38 12.39,6.2 v12.39,5.28
  Bottom 0.305: v17.58,12.9 18.49,13.82 19.1,13.82 20.02,12.9 20.02,11.68 U1.25 | v12.39,5.28 11.48,4.37 11.48,3.45 PAD24.1
A3  (via drill 0.35 layers 15-16)
  Route15 0.305: v18.8,12.9 18.8,11.68 13.31,6.2 13.31,4.98 12.7,4.37 11.48,4.37 v10.87,4.98
  Bottom 0.305: v18.8,12.9 19.1,12.6 19.1,11.68 U1.26 | v10.87,4.98 10.57,4.98 9.65,4.06 9.65,3.45 PAD25.1
A6  (1 unrouted)
A7  (via drill 0.35 layers 15-16)
  Route15 0.305: v17.27,17.17 4.17,30.28 v4.17,32.41
  Bottom 0.305: v17.27,17.17 19.71,14.73 21.23,14.73 U1.22 | v4.17,32.41 2.95,31.19 PAD29.1
ADC
  Top 0.305: R21.1 3.25,27.84 3.25,25.09 3.56,24.79 PAD7.1
D+  (1 unrouted)
D-  (1 unrouted)
DTR
  Top 0.305: T2.E 39.83,21.13 39.83,23.27 41.66,25.09 43.18,25.09 43.79,24.49 43.79,22.35 42.57,21.13 R10.2 42.57,20.83 44.09,19.3 44.7,19.3 45.01,19 45.01,17.48 47.75,14.73 48.97,14.73 U$1.13
E_0
  Top 0.305: SJR1.4 7.52,13.82 5.99,13.82 4.77,15.04 3.86,15.04 PAD8.1
E_2
  Top 0.305: SJR1.7 7.52,8.03 5.99,8.03 4.77,9.25 3.86,9.25 PAD11.1
E_3
  Top 0.305: SJR1.6 7.52,9.86 6.3,9.86 4.77,11.38 3.86,11.38 PAD10.1
E_5
  Top 0.305: SJR1.5 7.52,11.99 5.99,11.99 4.77,13.21 3.86,13.21 PAD9.1
E_8  (via drill 0.35 layers 1-2)
  Top 0.305: v25.2,4.67 26.42,3.45 R3.1 | v22.15,7.72 23.67,7.72 SJR1.10 | v5.99,6.81 5.38,7.42 3.86,7.42 PAD16.1
  Route2 0.305: v22.15,7.72 24.59,5.28 | 24.59,5.28 v25.2,4.67 | v5.99,6.81 7.82,6.81 13.61,1.02 20.32,1.02 24.59,5.28
E_ADC
  Top 0.305: R20.1 26.42,26.31 20.62,26.31 19.1,27.84 5.99,27.84 R21.2 5.69,28.14 4.47,29.36 2.03,29.36 0.81,28.14 0.81,5.89 2.34,4.37 8.43,4.37 9.96,5.89 9.96,15.95 8.74,17.17 8.43,17.17 7.82,17.78 SJR1.2
GND  (via drill 0.35)  (6 unrouted)
  Top 0.305: U$1.1 43.48,18.39 41.66,18.39 38.91,15.65 C5.2 | 34.34,19.91 38.61,15.65 C5.2 | 34.34,19.91 32.82,21.44 32.82,22.66 29.46,26.01 R20.2 29.16,26.31 v27.94,27.53 20.32,27.53 19.41,28.45 8.74,28.45 7.52,29.67 v5.99,29.67 | C5.2 38.91,15.34 38.91,13.82 C4.2 38.91,13.51 39.83,12.6 41.05,12.6 C6.2 | v1.73,11.38 1.73,7.11 2.95,5.89 3.56,5.89 PAD17.1 | 47.45,6.5 49.28,4.67 U$2.P$2 | 47.45,6.5 46.84,7.11 U$2.5 | R3.2 29.46,3.45 30.68,4.67 30.68,5.89 32.21,7.42 LED2.C 32.51,7.72 32.51,10.16 C15.1 32.82,10.16 32.82,18.39 34.34,19.91 | 47.45,6.5 42.88,1.93 30.68,1.93 29.77,2.85 | 29.77,2.85 29.46,3.15 R3.2 | 22.15,2.85 23.67,4.37 23.67,5.59 SJR1.9 23.67,5.89 22.76,5.89 20.32,8.33 14.53,8.33 | 22.15,2.85 20.32,1.02 5.38,1.02 3.56,2.85 C10.2 | 14.53,8.33 v12.7,8.33 | 29.77,2.85 27.94,1.02 23.98,1.02 22.15,2.85 | 29.77,2.85 R3.2 | 14.53,8.33 v14.53,13.21
  Bottom 0.305: 26.72,23.88 26.42,23.88 25.5,24.79 IC6.1 | 26.72,23.88 28.85,21.74 28.85,20.52 26.42,18.09 25.5,18.09 IC5.1 25.2,17.78 25.2,15.95 24.59,15.34 C14.2 24.59,15.04 24.59,12.9 C9.2 24.59,12.6 27.33,9.86 27.33,7.42 25.5,5.59 24.89,5.59 IC4.1 24.89,5.28 25.5,4.67 25.5,3.45 C13.2 25.81,3.15 27.33,1.63 30.07,1.63 33.43,4.98 34.04,4.98 PAD6.1 | 26.72,23.88 27.94,25.09 v27.94,27.53 27.94,29.67 24.59,33.02 22.15,33.02 21.23,32.11 21.23,31.19 PAD21.1 | v5.99,29.67 5.99,28.45 C12.2 | 13.92,14.73 13.01,14.73 U1.3 12.7,14.73 10.87,14.73 10.26,14.12 7.52,14.12 5.99,15.65 | 13.92,14.73 14.22,15.04 14.22,15.95 13.92,16.26 13.01,16.26 U1.5 | 5.99,15.65 5.99,22.35 C11.2 | 5.99,15.65 v1.73,11.38 | v12.7,8.33 C7.2 | 13.92,14.73 14.53,14.12 v14.53,13.21
IO0  (via drill 0.35 layers 1-2)
  Top 0.305: v37.69,22.66 38,22.66 38.61,23.27 T2.C | v27.94,9.55 26.72,8.33 R4.1 | v22.15,10.16 22.15,10.46 22.76,11.07 23.06,11.07 23.67,11.68 SJR1.12
  Route2 0.305: v37.69,22.66 37.69,18.69 36.47,17.48 35.86,17.48 v27.94,9.55 27.33,10.16 v22.15,10.16
IO2  (via drill 0.35 layers 1-2)
  Top 0.305: v25.2,6.81 25.5,6.81 26.42,5.89 R9.2 | v22.15,8.94 23.06,8.94 23.67,9.55 SJR1.11
  Route2 0.305: v25.2,6.81 24.28,6.81 v22.15,8.94
M+
  Bottom 0.305: M1.1 15.44,28.14 15.44,30.89 PAD18.1
M-  (via drill 0.35)
  Top 0.305: v17.88,31.19 v20.02,29.06
  Bottom 0.305: v20.02,29.06 19.1,28.14 M1.4 | v17.88,31.19 16.05,33.02 14.53,33.02 13.61,32.11 13.61,31.19 PAD19.1
N$1  (via drill 0.35)
  Top 0.305: v11.48,18.69 11.48,8.64 v11.79,8.33
  Bottom 0.305: v11.48,18.69 12.7,18.69 U1.8 | 11.79,8.03 11.79,7.72 12.7,6.81 C7.1 | 11.79,8.03 9.04,8.03 Q3.1 | 11.79,8.03 v11.79,8.33
N$2  (via drill 0.35 layers 1-2)
  Top 0.305: v27.94,23.27 29.16,23.27 R2.2 | v5.69,16.26 7.21,16.26 7.52,15.95 SJR1.3
  Route2 0.305: v27.94,23.27 9.04,23.27 5.08,19.3 5.08,16.87 v5.69,16.26
N$3
  Bottom 0.305: D1.3 40.74,22.66 43.18,22.66 43.79,22.05 IC2.1 44.09,21.74 44.7,21.13 44.7,19.91 R6.2
N$5
  Bottom 0.305: R5.2 49.89,3.15 47.75,3.15 R8.2 47.45,3.15 45.31,5.28 45.31,5.89 C2.1 45.01,6.2 45.01,8.64 IC1.1 43.79,9.55 41.96,11.38 41.35,11.38 B1.AC1
N$6
  Bottom 0.305: R5.1 49.89,5.89 47.75,5.89 R8.1 47.45,5.89 47.45,8.64 44.09,11.99 IC1.2
N$7
  Bottom 0.305: IC1.3 44.09,14.43 45.31,14.43 47.75,16.87 C1.1 47.75,17.17 47.75,19.61 R6.1 47.75,19.91 47.75,20.52 45.01,23.27 44.7,23.27 44.09,23.88 IC2.2
N$13
  Top 0.305: U$1.8 43.48,9.55 39.83,9.55 38.91,10.46 C4.1 38.61,10.77 34.34,15.04 Q1.1
N$14
  Top 0.305: U$1.7 43.79,10.77 45.92,10.77 48.06,8.64 50.19,8.64 51.11,9.55 51.11,24.18 49.58,25.7 41.66,25.7 41.35,26.01 41.35,28.45 41.05,28.75 38.61,28.75 34.34,24.49 Q1.2 34.34,24.18 34.34,22.66 37.08,19.91 37.39,19.91 38.61,18.69 C5.1
N$15
  Top 0.305: T1.B 47.75,21.13 45.31,21.13 R10.1
N$16  (2 unrouted)
N$17
  Bottom 0.305: R7.2 42.88,29.97 41.05,29.97 LED1.A
N$18
  Top 0.305: T2.B 38,20.83 38.91,19.91 40.44,19.91 41.05,20.52 41.05,22.05 42.27,23.27 R13.1
N$19  (via drill 0.35 layers 1-2)
  Top 0.305: v45.01,15.65 43.79,15.65 U$1.3 | v31.9,12.29 31.9,14.12 30.38,15.65 29.46,15.65 R15.2
  Route2 0.305: v45.01,15.65 35.25,15.65 v31.9,12.29
N$20  (via drill 0.35 layers 1-2)
  Top 0.305: v42.27,17.48 42.57,17.17 43.48,17.17 U$1.2 | v33.12,19.91 30.68,19.91 29.46,18.69 R14.2
  Route2 0.305: v42.27,17.48 42.27,19.3 38,23.57 36.78,23.57 v33.12,19.91
N$21  (1 unrouted)
N$22
  Top 0.305: R12.2 37.08,7.72 35.25,7.72 LED2.A
N$23
  Top 0.305: R22.2 45.92,27.23 42.88,27.23 LED3.A
NRST  (via drill 0.35 layers 1-2)
  Top 0.305: v46.84,23.57 48.67,23.57 T1.C | v32.21,20.83 29.46,20.83 R1.2 | v20.32,19.61 7.82,19.61 SJR1.1
  Route2 0.305: v46.84,23.57 38.91,23.57 38.3,24.18 35.56,24.18 v32.21,20.83 31.29,21.74 24.89,21.74 22.76,19.61 v20.32,19.61
RTS
  Top 0.305: U$1.14 49.28,15.95 49.89,15.95 50.5,16.56 50.5,19 49.89,19.61 49.89,20.83 T1.E 49.89,21.13 49.89,24.49 46.23,24.49 45.31,23.57 R13.2
RX
  Top 0.305: R14.1 26.42,18.39 24.28,18.39 23.98,18.09 SJR1.15 23.67,18.09 23.06,18.09 20.02,21.13 3.86,21.13 PAD12.1
SCL3  (via drill 0.35, 0.35 layers 1-2, 0.35 layers 15-16)
  Top 0.305: v20.93,11.68 20.93,13.21 23.67,15.95 SJR1.14 23.98,15.95 26.42,13.51 R16.1 | v5.99,19 3.86,19 PAD15.1
  Route2 0.305: v5.99,19 9.96,19 11.18,17.78 14.83,17.78 v20.93,11.68
  Route15 0.305: v16.97,1.63 16.97,7.72 v20.93,11.68
  Bottom 0.305: v16.97,1.63 16.97,2.54 Q4.2
SCL5  (via drill 0.35 layers 15-16)
  Route15 0.305: v19.1,5.59 v19.1,8.33 20.62,8.33 23.37,11.07 23.37,12.6 21.54,14.43 14.53,14.43 v7.21,7.11
  Bottom 0.305: v19.1,5.59 18.49,4.98 17.88,4.98 Q4.3 | v19.1,8.33 17.88,9.55 R17.2 17.58,9.86 17.58,11.38 U1.28 | v7.21,7.11 7.21,6.2 5.99,4.98 5.99,3.45 PAD27.1
SDA3  (via drill 0.35, 0.35 layers 1-2)
  Top 0.305: v19.71,9.25 22.15,11.68 22.15,12.6 23.06,13.51 23.67,13.51 SJR1.13 | v27.94,11.07 26.72,11.07 R18.1 | v5.99,17.17 3.86,17.17 PAD14.1
  Route2 0.305: v19.71,1.93 v19.71,9.25 20.02,9.55 | v27.94,11.07 21.54,11.07 20.02,9.55 | v5.99,17.17 12.39,17.17 20.02,9.55
  Bottom 0.305: v19.71,1.93 20.02,1.93 20.62,2.54 Q2.2
SDA5  (via drill 0.35 layers 15-16)  (1 unrouted)
  Route15 0.305: v7.21,4.98 14.22,11.99 15.75,11.99 16.66,12.9 16.66,13.21 17.27,13.82 21.23,13.82 22.76,12.29 22.76,11.68 v21.84,10.77
  Bottom 0.305: Q2.3 21.84,4.98 21.84,8.03 20.32,9.55 R19.2 20.32,9.86 21.23,10.77 v21.84,10.77 | v7.21,4.98 7.52,4.67 7.52,3.45 PAD26.1
TX  (via drill 0.35 layers 1-2)
  Top 0.305: v27.94,18.09 27.94,17.17 26.72,15.95 R15.1 | v25.2,20.83 23.98,19.61 SJR1.16 23.67,19.91 20.93,22.66 3.86,22.66 PAD13.1
  Route2 0.305: v25.2,20.83 v27.94,18.09
V3
  Top 0.305: U$1.4 43.48,14.73 41.96,14.73 41.35,15.34 C6.1
VBAT  (via drill 0.35 layers 15-16)  (1 unrouted)
  Route15 0.305: v26.42,9.55 27.33,9.55 v28.55,10.77 27.03,12.29 v27.03,21.13 v27.03,25.4
  Bottom 0.305: PAD4.1 38,5.28 38,5.89 32.51,11.38 B1.+ 32.21,11.38 31.6,10.77 v28.55,10.77 | v26.42,9.55 26.11,9.86 24.89,9.86 IC4.3 | v27.03,21.13 27.03,21.44 26.11,22.35 25.5,22.35 IC5.3 | v27.03,25.4 27.03,28.14 26.42,28.75 26.11,28.75 25.5,29.36 IC6.3
VCC
  Top 0.305: U$2.1 44.09,7.42 40.44,7.42 R12.1 | C15.2 36.47,10.16 37.39,9.25 38.61,9.25 40.13,7.72 R12.1 | D2.A 37.39,4.06 37.39,4.67 40.13,7.42 R12.1